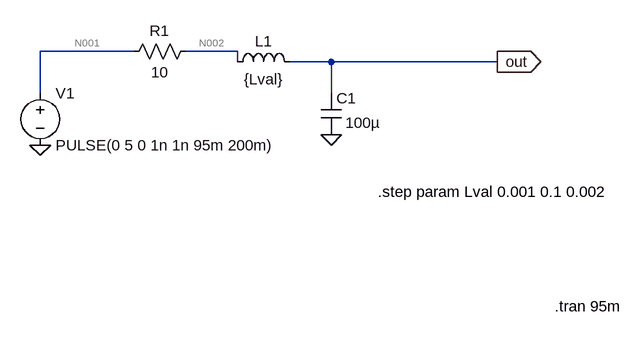
[diagram p0: schematic rlc_normal_sweep.asc]
rlc_normal_sweep.asc, the LTspice schematic file:
Version 4.1
SHEET 1 880 680
WIRE -688 -1136 -832 -1136
WIRE -528 -1136 -608 -1136
WIRE -528 -1120 -528 -1136
WIRE -384 -1120 -448 -1120
WIRE -128 -1120 -384 -1120
WIRE -832 -1072 -832 -1136
WIRE -384 -1072 -384 -1120
FLAG -832 -992 0
FLAG -384 -1008 0
FLAG -128 -1120 out
IOPIN -128 -1120 Out
SYMBOL voltage -832 -1088 R0
WINDOW 123 0 0 Left 0
WINDOW 39 0 0 Left 0
SYMATTR InstName V1
SYMATTR Value PULSE(0 5 0 1n 1n 95m 200m)
SYMBOL res -592 -1152 R90
WINDOW 0 0 56 VBottom 2
WINDOW 3 32 56 VTop 2
SYMATTR InstName R1
SYMATTR Value 10
SYMBOL ind -544 -1104 R270
WINDOW 0 32 56 VTop 2
WINDOW 3 5 56 VBottom 2
SYMATTR InstName L1
SYMATTR Value {Lval}
SYMATTR SpiceLine Rser=1m
SYMBOL cap -400 -1072 R0
WINDOW 3 38 46 Left 2
SYMATTR Value 100µ
SYMATTR InstName C1
TEXT -40 -744 Left 2 !.tran 95m
TEXT -312 -920 Left 2 !.step param Lval 0.001 0.1 0.002

The netlist it stands for:
* rlc_normal_sweep.asc
V1 N001 0 PULSE(0 5 0 1n 1n 95m 200m)
R1 N002 N001 10
L1 N002 out {Lval} Rser=1m
C1 out 0 100µ
.tran 95m
.step param Lval 0.001 0.1 0.002
.backanno
.end

* Results of the author's LTspice run, read from the files saved beside the schematic
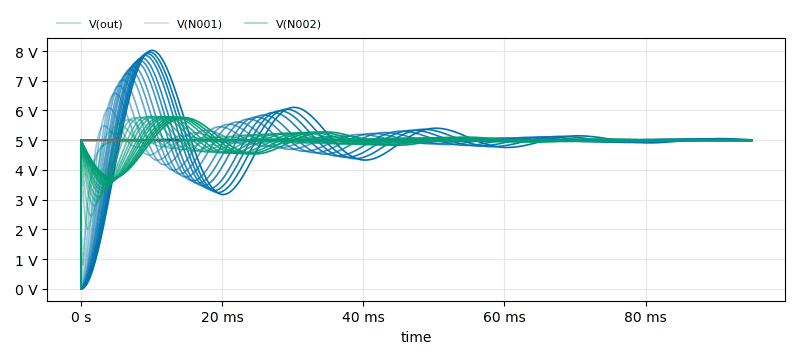
[diagram p1: Transient Analysis of rlc_normal_sweep.asc, plotted from the saved traces]
* Transient Analysis, 51 runs:
*   V(out) [run 1]: min 0 V, max 5 V, average 4.947 V, rms 4.962 V, last 5 V
*   V(out) [run 2]: min 0 V, max 5.483 V, average 4.947 V, rms 4.97 V, last 5 V
*   V(out) [run 3]: min 0 V, max 6.081 V, average 4.947 V, rms 4.978 V, last 5 V
*   V(out) [run 4]: min 0 V, max 6.576 V, average 4.947 V, rms 4.988 V, last 5 V
*   V(out) [run 5]: min 0 V, max 6.833 V, average 4.947 V, rms 4.996 V, last 5 V
*   V(out) [run 6]: min 0 V, max 7.035 V, average 4.947 V, rms 5.004 V, last 5 V
*   V(out) [run 7]: min 0 V, max 7.246 V, average 4.947 V, rms 5.014 V, last 5 V
*   V(out) [run 8]: min 0 V, max 7.375 V, average 4.947 V, rms 5.022 V, last 5 V
*   V(N001) [run 1]: min 0 V, max 5 V, average 5 V, rms 5 V, last 5 V
*   V(N001) [run 2]: min 0 V, max 5 V, average 5 V, rms 5 V, last 5 V
*   V(N001) [run 3]: min 0 V, max 5 V, average 5 V, rms 5 V, last 5 V
*   V(N001) [run 4]: min 0 V, max 5 V, average 5 V, rms 5 V, last 5 V
*   V(N001) [run 5]: min 0 V, max 5 V, average 5 V, rms 5 V, last 5 V
*   V(N001) [run 6]: min 0 V, max 5 V, average 5 V, rms 5 V, last 5 V
*   V(N001) [run 7]: min 0 V, max 5 V, average 5 V, rms 5 V, last 5 V
*   V(N001) [run 8]: min 0 V, max 5 V, average 5 V, rms 5 V, last 5 V
*   V(N002) [run 1]: min 0 V, max 5 V, average 4.947 V, rms 4.96 V, last 5 V
*   V(N002) [run 2]: min 0 V, max 5.289 V, average 4.947 V, rms 4.96 V, last 5 V
*   V(N002) [run 3]: min 0 V, max 5.55 V, average 4.947 V, rms 4.96 V, last 5 V
*   V(N002) [run 4]: min 0 V, max 5.695 V, average 4.947 V, rms 4.96 V, last 5 V
*   V(N002) [run 5]: min 0 V, max 5.746 V, average 4.947 V, rms 4.96 V, last 5 V
*   V(N002) [run 6]: min 0 V, max 5.774 V, average 4.947 V, rms 4.96 V, last 5 V
*   V(N002) [run 7]: min 0 V, max 5.792 V, average 4.947 V, rms 4.96 V, last 5 V
*   V(N002) [run 8]: min 0 V, max 5.798 V, average 4.947 V, rms 4.96 V, last 5 V